# EAGLE schematic untitled (EAGLE 9.6.2)
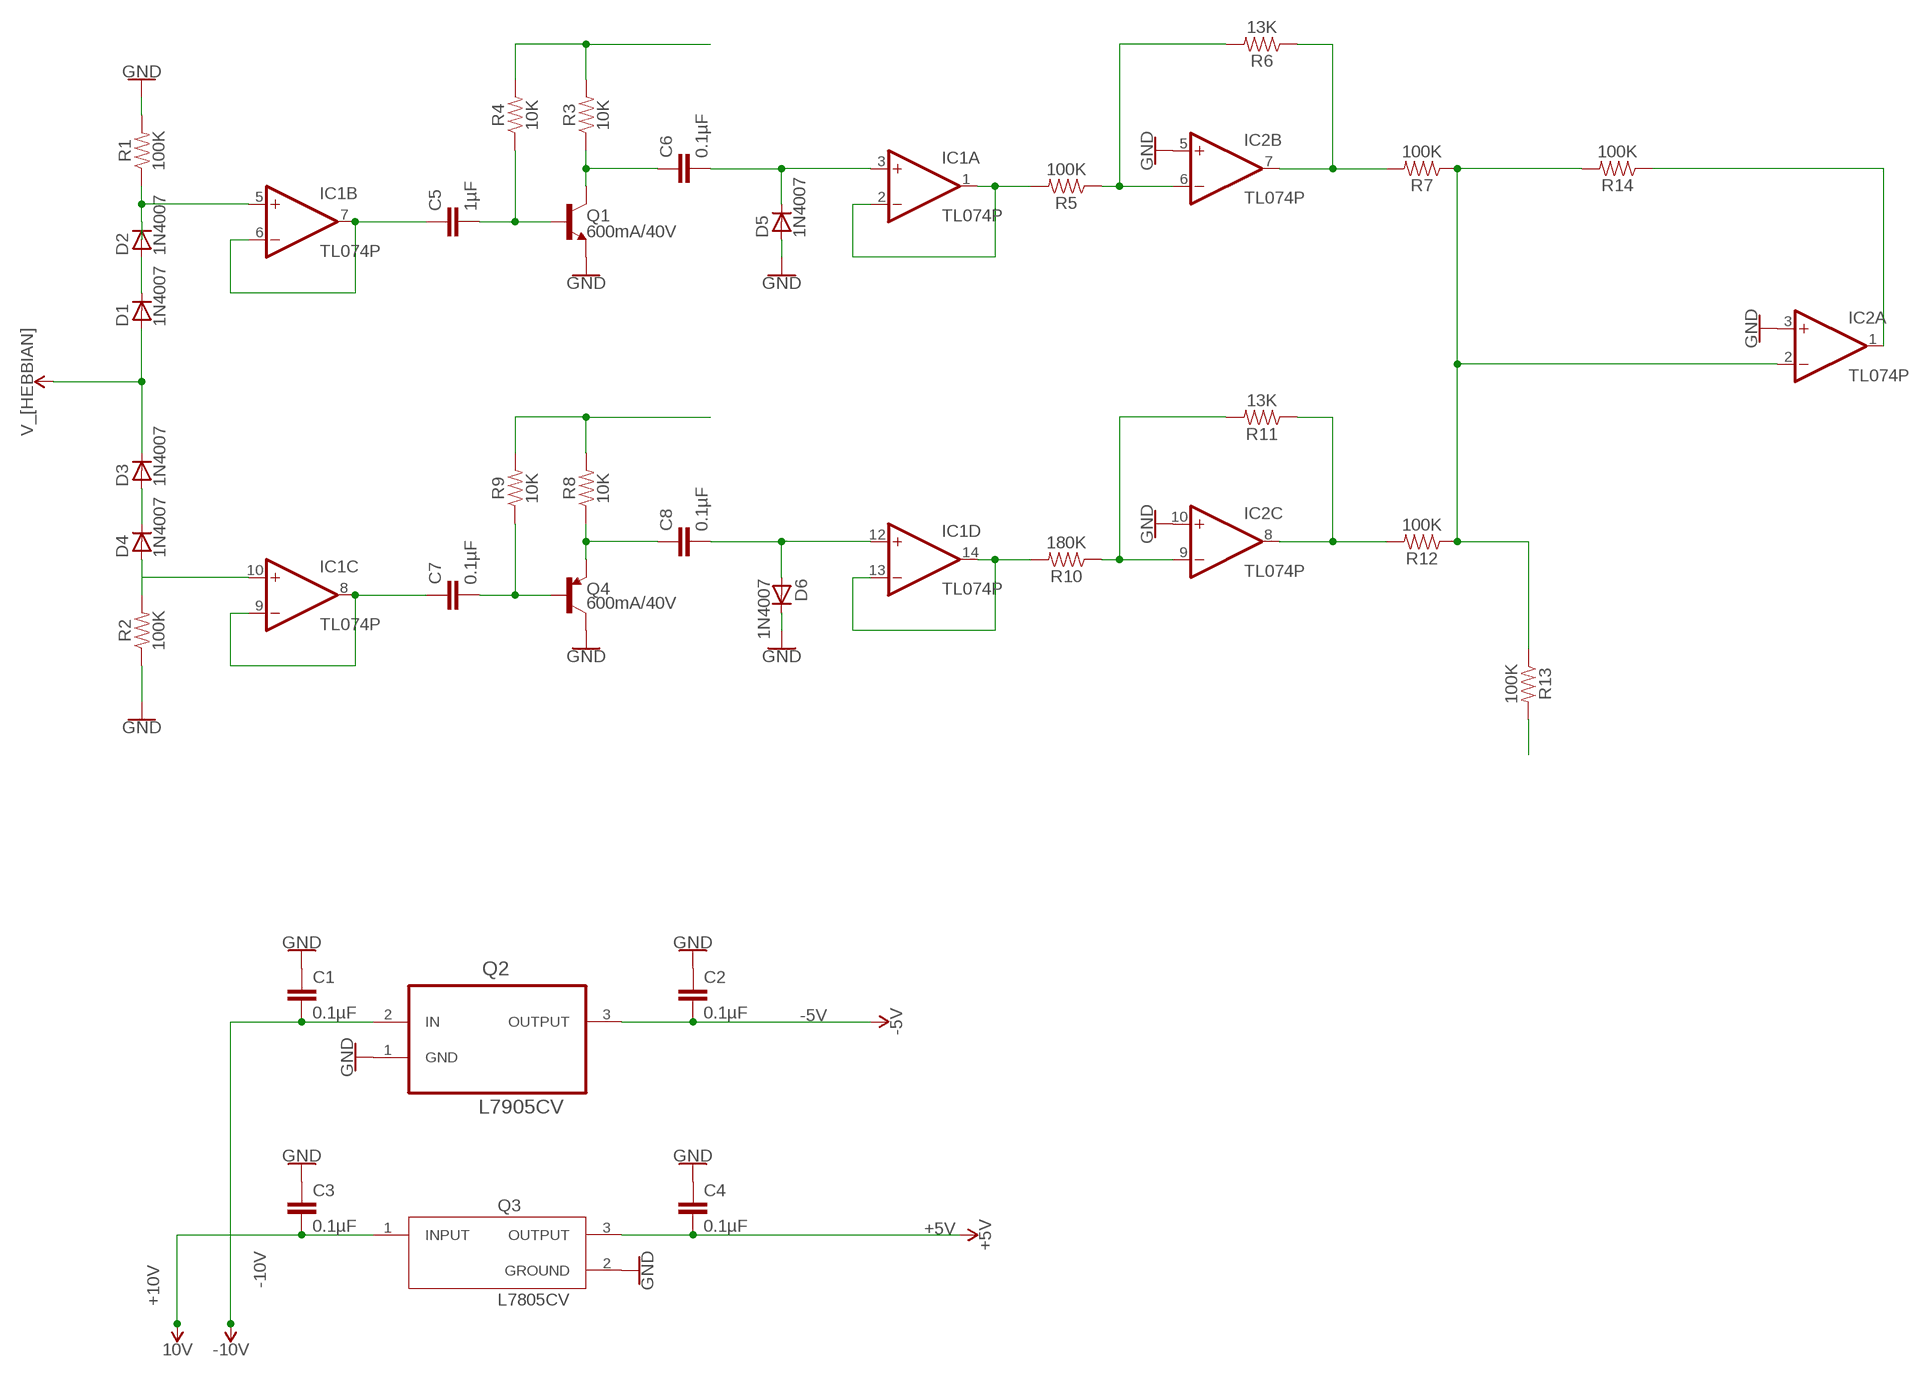
[diagram p0: schematic, sheet 1]

## Parts
C1  0.1µF  0.33UF/330NF-0805-50V-10%  [0805]
C2  0.1µF  0.33UF/330NF-0805-50V-10%  [0805]
C3  0.1µF  0.33UF/330NF-0805-50V-10%  [0805]
C4  0.1µF  0.33UF/330NF-0805-50V-10%  [0805]
C5  1µF  0.33UF/330NF-0805-50V-10%  [0805]
C6  0.1µF  0.33UF/330NF-0805-50V-10%  [0805]
C7  0.1µF  0.33UF/330NF-0805-50V-10%  [0805]
C8  0.1µF  0.33UF/330NF-0805-50V-10%  [0805]
D1  1N4007  [SMA]
D2  1N4007  [SMA]
D3  1N4007  [SMA]
D4  1N4007  [SMA]
D5  1N4007  [SMA]
D6  1N4007  [SMA]
IC1  TL074P  [DIL14]
IC2  TL074P  [DIL14]
Q1  600mA/40V  TRANS_NPN-MMBT2222AL  [SOT23-3]
Q2  L7905CV  [TO254P450X1020X1935-3P]
Q3  L7805CV  [TO255P1040X460X1968-3]
Q4  600mA/40V  TRANS_PNP-MMBT4403  [SOT23-3]
R1  100K  0.22OHM-0805-1/4W-1%  [0805]
R2  100K  0.22OHM-0805-1/4W-1%  [0805]
R3  10K  0.22OHM-0805-1/4W-1%  [0805]
R4  10K  0.22OHM-0805-1/4W-1%  [0805]
R5  100K  0.22OHM-0805-1/4W-1%  [0805]
R6  13K  0.22OHM-0805-1/4W-1%  [0805]
R7  100K  0.22OHM-0805-1/4W-1%  [0805]
R8  10K  0.22OHM-0805-1/4W-1%  [0805]
R9  10K  0.22OHM-0805-1/4W-1%  [0805]
R10  180K  0.22OHM-0805-1/4W-1%  [0805]
R11  13K  0.22OHM-0805-1/4W-1%  [0805]
R12  100K  0.22OHM-0805-1/4W-1%  [0805]
R13  100K  0.22OHM-0805-1/4W-1%  [0805]
R14  100K  0.22OHM-0805-1/4W-1%  [0805]

## Nets
12V: D1.A D3.K(C) ; supply symbol labelled V_[HEBBIAN]
+10V: C3.2 Q3.1(INPUT) ; supply symbol labelled 10V
-5V: C2.2 Q2.3(OUTPUT)
-10V: C1.2 Q2.2(IN)
GND: C1.1 C2.1 C3.1 C4.1 D5.A D6.K(C) IC2.3(A:+IN) IC2.5(B:+IN) IC2.10(C:+IN) Q1.2(E) Q2.1(GND) Q3.2(GROUND) Q4.3(C) R1.2 R2.1
N$1: D1.K(C) D2.A
N$2: D2.K(C) IC1.5(B:+IN) R1.1
N$3: C5.1 IC1.6(B:-IN) IC1.7(B:OUT)
N$4: D3.A D4.K(C)
N$5: D4.A R2.2
N$6: C5.2 Q1.1(B) R4.1
N$7: C6.1 Q1.3(C) R3.1
N$8: R3.2 R4.2
N$9: C4.2 Q3.3(OUTPUT)
N$10: C6.2 D5.K(C) IC1.3(A:+IN)
N$11: IC1.1(A:OUT) IC1.2(A:-IN) R5.2
N$12: IC2.6(B:-IN) R5.1 R6.2
N$13: IC2.7(B:OUT) R6.1 R7.2
N$14: IC1.10(C:+IN)
N$15: C7.1 IC1.8(C:OUT) IC1.9(C:-IN)
N$16: C7.2 Q4.1(B) R9.1
N$17: C8.1 Q4.2(E) R8.1
N$18: R8.2 R9.2
N$19: C8.2 D6.A IC1.12(D:+IN)
N$20: IC1.13(D:-IN) IC1.14(D:OUT) R10.2
N$21: IC2.9(C:-IN) R10.1 R11.2
N$22: IC2.8(C:OUT) R11.1 R12.2
N$23: IC2.2(A:-IN) R7.1 R12.1 R13.1 R14.2
N$24: R13.2
N$25: IC2.1(A:OUT) R14.1
Unconnected: IC2.12(D:+IN) IC2.13(D:-IN) IC2.14(D:OUT)

## Power pins joined to a net without a drawn wire
V+: IC1.4(P:V+) IC2.4(P:V+)
V-: IC1.11(P:V-) IC2.11(P:V-)

## Library data of the parts
C1-C8 = SparkFun-Capacitors:0.33UF/330NF: 0.33µF/330nF ceramic capacitors A capacitor is a passive two-terminal electrical component used to store electrical energy temporarily in an electric field.; PROD_ID: CAP-08469; VALUE: 0.33µF
D1-D6 = casovac:1N4007
IC1 IC2 = linear3:TL074: OP AMP
Q1 = SparkFun-DiscreteSemi:TRANS_NPN: NPN transistor Current controlled devices typically used to amplify current or used as a switch. BC547 - COM-08928 <http://www.sparkfun.com/products/8928> (TO-92 45V 100mA) (1.Collector 2.Base 3.Emitter) 2N3904 - COM-00521 <http://www.sparkfun.com/products/521> (TO-92 40V 200mA) (1.Emitter 2.Base 3.Collector) P2N2222A - COM-12852 <http://www.sparkfun.com/products/12852> (TO-92 40V 600mA) (1.Collector 2.Base 3.Emitter); PROD_ID: TRANS-08049
Q2 = L7905CV:L7905CV: 2 % negative voltage regulators Check prices <https://pricing.snapeda.com/parts/L7905CV/STMicroelectronics/view-part?ref=eda>; AVAILABILITY: Warning; DESCRIPTION: Linear Voltage Regulator IC 1 Output 1.5A TO-220; MF: STMicroelectronics; MP: L7905CV; PACKAGE: TO-220 STMicroelectronics; PRICE: None; PURCHASE-URL: https://pricing.snapeda.com/search/part/L7905CV/?ref=eda
Q3 = L7805CV:L7805CV: Standard Regulator Pos 5V 1.5A 3-Pin(3+Tab) TO-220 Standard Regulator Pos 5V 1.5A 3-Pin(3+Tab) TO-220 Check prices <https://pricing.snapeda.com/parts/L7805CV/STMicroelectronics/view-part?ref=eda>; AVAILABILITY: Good; DESCRIPTION: Linear Voltage Regulator IC 1 Output 1.5A TO-220; MF: STMicroelectronics; MP: L7805CV; PACKAGE: TO-220 STMicroelectronics; PRICE: None; PURCHASE-URL: https://pricing.snapeda.com/search/part/L7805CV/?ref=eda
Q4 = SparkFun-DiscreteSemi:TRANS_PNP: PNP transistor Current controlled devices typically used to amplify current or used as a switch. SparkFun Products: SparkFun Serial Enabled 16x2 LCD - Red on Black <https://www.sparkfun.com/products/9068> SparkFun Logomatic <https://www.sparkfun.com/products/12772>; PROD_ID: TRANS-09245
R1-R14 = SparkFun-Resistors:0.22OHM: 0.22Ω resistor A resistor is a passive two-terminal electrical component that implements electrical resistance as a circuit element. Resistors act to reduce current flow, and, at the same time, act to lower voltage levels within circuits. - Wikipedia; PROD_ID: RES-09883; VALUE: 0.22